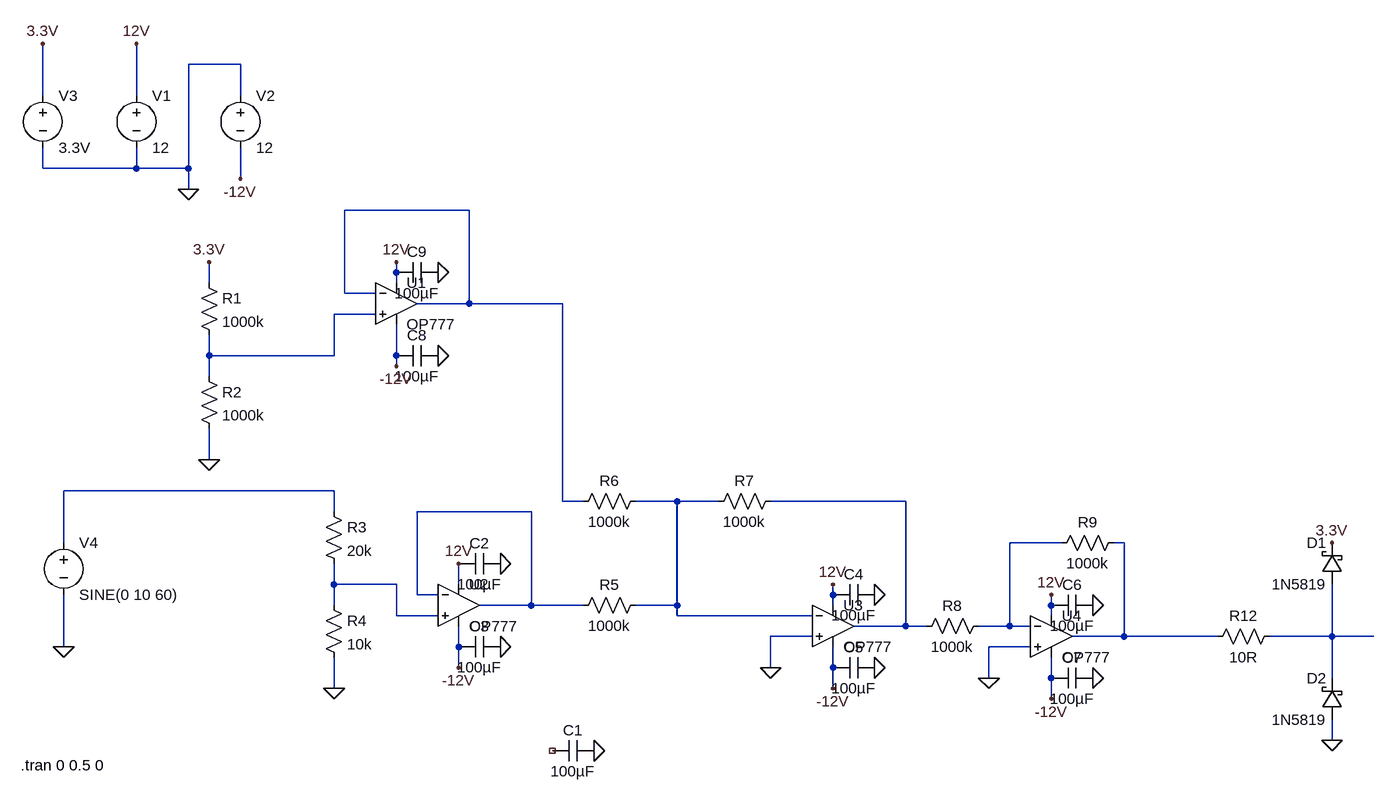
[diagram p0: schematic Input.asc]
Input.asc, the LTspice schematic file:
Version 4
SHEET 1 1700 912
WIRE -48 -192 -128 -192
WIRE -352 -144 -352 -224
WIRE -208 -144 -208 -224
WIRE -48 -144 -48 -192
WIRE -352 -32 -352 -64
WIRE -208 -32 -208 -64
WIRE -208 -32 -352 -32
WIRE -128 -32 -128 -192
WIRE -128 -32 -208 -32
WIRE -48 -16 -48 -64
WIRE -128 0 -128 -32
WIRE 304 32 112 32
WIRE 192 128 192 112
WIRE -96 144 -96 112
WIRE 192 144 192 128
WIRE 112 160 112 32
WIRE 160 160 112 160
WIRE 304 176 304 32
WIRE 304 176 224 176
WIRE 448 176 304 176
WIRE 160 192 96 192
WIRE -96 256 -96 224
WIRE 96 256 96 192
WIRE 96 256 -96 256
WIRE 192 256 192 208
WIRE 192 272 192 256
WIRE -96 288 -96 256
WIRE -96 416 -96 368
WIRE 96 464 -320 464
WIRE 448 480 448 176
WIRE 480 480 448 480
WIRE 624 480 560 480
WIRE 688 480 624 480
WIRE 976 480 768 480
WIRE 96 496 96 464
WIRE 400 496 224 496
WIRE -320 544 -320 464
WIRE 1216 544 1136 544
WIRE 1312 544 1296 544
WIRE 96 608 96 576
WIRE 192 608 96 608
WIRE 288 608 288 576
WIRE 224 624 224 496
WIRE 256 624 224 624
WIRE 864 624 864 608
WIRE 96 640 96 608
WIRE 400 640 400 496
WIRE 400 640 320 640
WIRE 480 640 400 640
WIRE 624 640 624 480
WIRE 624 640 560 640
WIRE 864 640 864 624
WIRE 1200 640 1200 624
WIRE 192 656 192 608
WIRE 256 656 192 656
WIRE 624 656 624 640
WIRE 832 656 624 656
WIRE 1200 656 1200 640
WIRE 976 672 976 480
WIRE 976 672 896 672
WIRE 1008 672 976 672
WIRE 1136 672 1136 544
WIRE 1136 672 1088 672
WIRE 1168 672 1136 672
WIRE 832 688 768 688
WIRE 1312 688 1312 544
WIRE 1312 688 1232 688
WIRE 1456 688 1312 688
WIRE 1632 688 1632 608
WIRE 1632 688 1536 688
WIRE 1696 688 1632 688
WIRE -320 704 -320 624
WIRE 288 704 288 672
WIRE 1168 704 1104 704
WIRE 288 736 288 704
WIRE 768 736 768 688
WIRE 864 736 864 704
WIRE 1104 752 1104 704
WIRE 1200 752 1200 720
WIRE 1632 752 1632 688
WIRE 96 768 96 720
WIRE 864 768 864 736
WIRE 1200 784 1200 752
WIRE 1632 848 1632 816
FLAG -128 0 0
FLAG -208 -224 12V
FLAG -48 -16 -12V
FLAG 192 272 -12V
FLAG 192 112 12V
FLAG -352 -224 3.3V
FLAG -96 112 3.3V
FLAG -96 416 0
FLAG -320 704 0
FLAG 96 768 0
FLAG 288 736 -12V
FLAG 288 576 12V
FLAG 864 768 -12V
FLAG 864 608 12V
FLAG 1200 784 -12V
FLAG 1200 624 12V
FLAG 768 736 0
FLAG 1104 752 0
FLAG 496 864 0
FLAG 352 576 0
FLAG 352 704 0
FLAG 928 624 0
FLAG 928 736 0
FLAG 1264 640 0
FLAG 1264 752 0
FLAG 256 256 0
FLAG 256 128 0
FLAG 1632 544 3.3V
FLAG 1632 848 0
SYMBOL voltage -208 -160 R0
WINDOW 123 0 0 Left 0
WINDOW 39 0 0 Left 0
SYMATTR InstName V1
SYMATTR Value 12
SYMBOL voltage -48 -160 R0
WINDOW 123 0 0 Left 0
WINDOW 39 0 0 Left 0
SYMATTR InstName V2
SYMATTR Value 12
SYMBOL voltage -352 -160 R0
WINDOW 123 0 0 Left 0
WINDOW 39 0 0 Left 0
SYMATTR InstName V3
SYMATTR Value 3.3V
SYMBOL res -112 128 R0
SYMATTR InstName R1
SYMATTR Value 1000k
SYMBOL res -112 272 R0
SYMATTR InstName R2
SYMATTR Value 1000k
SYMBOL res 80 480 R0
SYMATTR InstName R3
SYMATTR Value 20k
SYMBOL res 80 624 R0
SYMATTR InstName R4
SYMATTR Value 10k
SYMBOL voltage -320 528 R0
WINDOW 123 0 0 Left 0
WINDOW 39 0 0 Left 0
SYMATTR InstName V4
SYMATTR Value SINE(0 10 60)
SYMBOL res 576 624 R90
WINDOW 0 0 56 VBottom 2
WINDOW 3 32 56 VTop 2
SYMATTR InstName R5
SYMATTR Value 1000k
SYMBOL res 576 464 R90
WINDOW 0 0 56 VBottom 2
WINDOW 3 32 56 VTop 2
SYMATTR InstName R6
SYMATTR Value 1000k
SYMBOL res 784 464 R90
WINDOW 0 0 56 VBottom 2
WINDOW 3 32 56 VTop 2
SYMATTR InstName R7
SYMATTR Value 1000k
SYMBOL res 1104 656 R90
WINDOW 0 0 56 VBottom 2
WINDOW 3 32 56 VTop 2
SYMATTR InstName R8
SYMATTR Value 1000k
SYMBOL res 1312 528 R90
WINDOW 0 0 56 VBottom 2
WINDOW 3 32 56 VTop 2
SYMATTR InstName R9
SYMATTR Value 1000k
SYMBOL cap 496 848 R90
WINDOW 0 0 32 VBottom 2
WINDOW 3 32 32 VTop 2
SYMATTR InstName C1
SYMATTR Value 100µF
SYMBOL cap 352 560 R90
WINDOW 0 0 32 VBottom 2
WINDOW 3 32 32 VTop 2
SYMATTR InstName C2
SYMATTR Value 100µF
SYMBOL cap 352 688 R90
WINDOW 0 0 32 VBottom 2
WINDOW 3 32 32 VTop 2
SYMATTR InstName C3
SYMATTR Value 100µF
SYMBOL cap 928 608 R90
WINDOW 0 0 32 VBottom 2
WINDOW 3 32 32 VTop 2
SYMATTR InstName C4
SYMATTR Value 100µF
SYMBOL cap 928 720 R90
WINDOW 0 0 32 VBottom 2
WINDOW 3 32 32 VTop 2
SYMATTR InstName C5
SYMATTR Value 100µF
SYMBOL cap 1264 624 R90
WINDOW 0 0 32 VBottom 2
WINDOW 3 32 32 VTop 2
SYMATTR InstName C6
SYMATTR Value 100µF
SYMBOL cap 1264 736 R90
WINDOW 0 0 32 VBottom 2
WINDOW 3 32 32 VTop 2
SYMATTR InstName C7
SYMATTR Value 100µF
SYMBOL cap 256 240 R90
WINDOW 0 0 32 VBottom 2
WINDOW 3 32 32 VTop 2
SYMATTR InstName C8
SYMATTR Value 100µF
SYMBOL cap 256 112 R90
WINDOW 0 0 32 VBottom 2
WINDOW 3 32 32 VTop 2
SYMATTR InstName C9
SYMATTR Value 100µF
SYMBOL Opamps\\OP777 192 112 R0
SYMATTR InstName U1
SYMBOL Opamps\\OP777 288 576 R0
SYMATTR InstName U2
SYMBOL Opamps\\OP777 864 608 R0
SYMATTR InstName U3
SYMBOL Opamps\\OP777 1200 624 R0
SYMATTR InstName U4
SYMBOL res 1552 672 R90
WINDOW 0 0 56 VBottom 2
WINDOW 3 32 56 VTop 2
SYMATTR InstName R12
SYMATTR Value 10R
SYMBOL schottky 1648 608 R180
WINDOW 0 24 64 Left 2
WINDOW 3 24 0 Left 2
SYMATTR InstName D1
SYMATTR Value 1N5819
SYMATTR Description Diode
SYMATTR Type diode
SYMBOL schottky 1648 816 R180
WINDOW 0 24 64 Left 2
WINDOW 3 24 0 Left 2
SYMATTR InstName D2
SYMATTR Value 1N5819
SYMATTR Description Diode
SYMATTR Type diode
TEXT -386 886 Left 2 !.tran 0 0.5 0

The netlist it stands for:
* Input.asc
V1 12V 0 12
V2 0 -12V 12
V3 3.3V 0 3.3V
R1 3.3V N002 1000k
R2 N002 0 1000k
R3 N003 N009 20k
R4 N009 0 10k
V4 N003 0 SINE(0 10 60)
R5 N004 N006 1000k
R6 N004 N001 1000k
R7 N005 N004 1000k
R8 N007 N005 1000k
R9 N008 N007 1000k
C1 0 NC_01 100µF
C2 0 12V 100µF
C3 0 -12V 100µF
C4 0 12V 100µF
C5 0 -12V 100µF
C6 0 12V 100µF
C7 0 -12V 100µF
C8 0 -12V 100µF
C9 0 12V 100µF
XU1 N002 N001 12V -12V N001 OP777  ; pins In+ In- V+ V- OUT
XU2 N009 N006 12V -12V N006 OP777  ; pins In+ In- V+ V- OUT
XU3 0 N004 12V -12V N005 OP777  ; pins In+ In- V+ V- OUT
XU4 0 N007 12V -12V N008 OP777  ; pins In+ In- V+ V- OUT
R12 N010 N008 10R
D1 N010 3.3V 1N5819
D2 0 N010 1N5819
.model D D
.lib standard.dio
.tran 0 0.5 0
.lib ADI.lib
.backanno
.end